# EAGLE schematic HV_amplifier_board_20210802 (EAGLE 9.7.0)
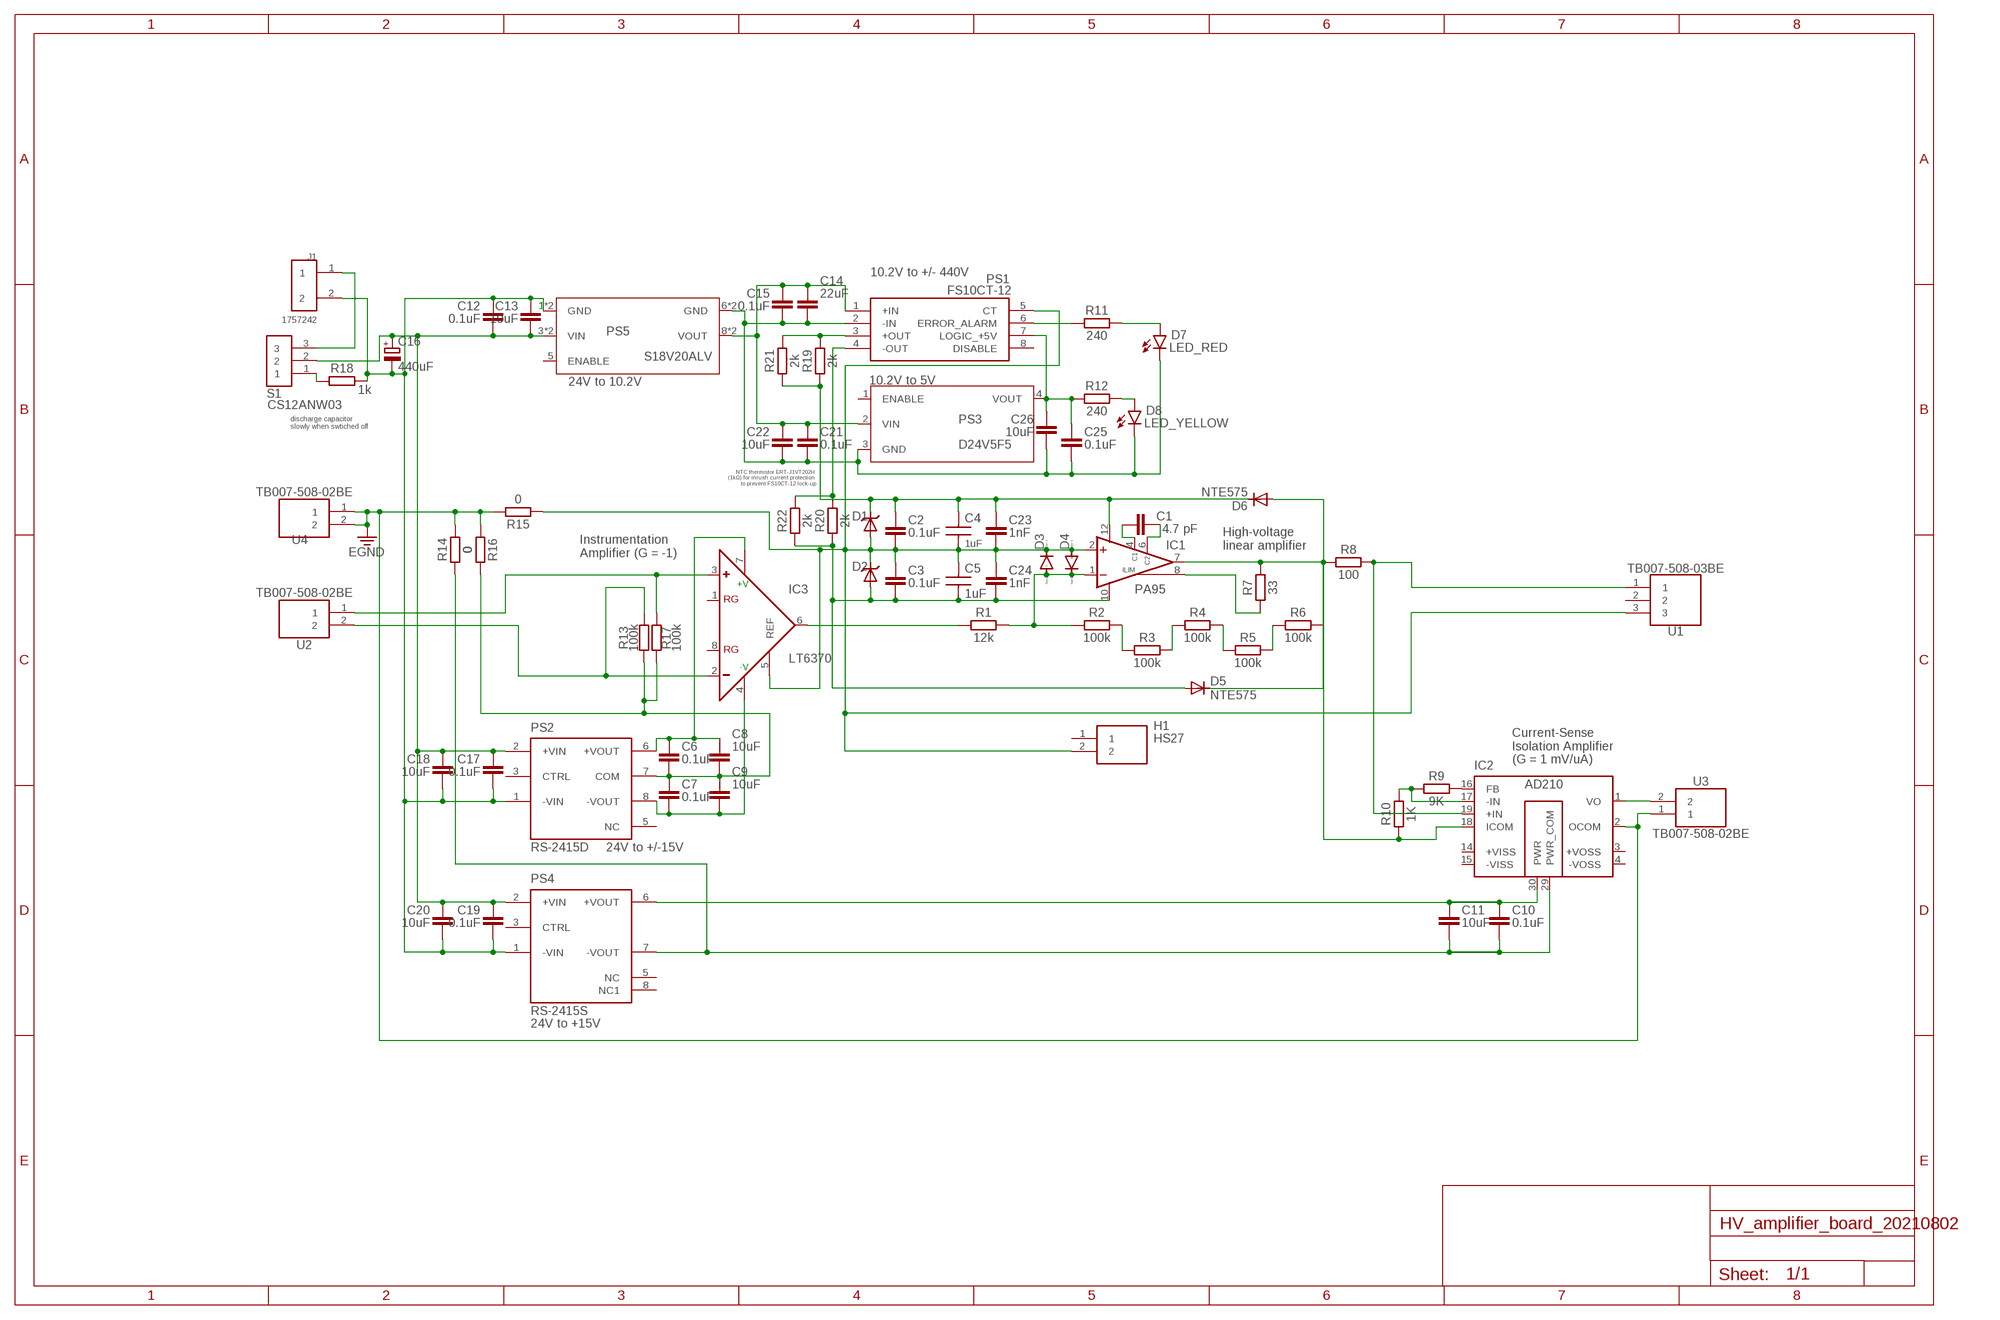
[diagram p0: schematic, sheet 1]

## Parts
C1  4.7 pF  C_DISC_10MM  [C_DISC_10MM]
C2  0.1uF  C_DISC_5.08  [C_DISC_5.08MM]
C3  0.1uF  C_DISC_5.08  [C_DISC_5.08MM]
C4  1uF  C_FILM_27.5MM  [C_FILM_27.5MM]
C5  1uF  C_FILM_27.5MM  [C_FILM_27.5MM]
C6  0.1uF  C_CHIP-0603(1608-METRIC)  [CAPC1608X85]
C7  0.1uF  C_CHIP-0603(1608-METRIC)  [CAPC1608X85]
C8  10uF  C_CHIP-1210(3225-METRIC)  [CAPC3225X135]
C9  10uF  C_CHIP-1210(3225-METRIC)  [CAPC3225X135]
C10  0.1uF  C_CHIP-0603(1608-METRIC)  [CAPC1608X85]
C11  10uF  C_CHIP-1210(3225-METRIC)  [CAPC3225X135]
C12  0.1uF  C_CHIP-0603(1608-METRIC)  [CAPC1608X85]
C13  10uF  C_CHIP-1210(3225-METRIC)  [CAPC3225X135]
C14  22uF  C_CHIP-1210(3225-METRIC)  [CAPC3225X135]
C15  0.1uF  C_CHIP-0603(1608-METRIC)  [CAPC1608X85]
C16  440uF  C-POL_RADIAL-11MM-DIA  [CAPPRD508W65D1000H1100B]
C17  0.1uF  C_CHIP-0603(1608-METRIC)  [CAPC1608X85]
C18  10uF  C_CHIP-1210(3225-METRIC)  [CAPC3225X135]
C19  0.1uF  C_CHIP-0603(1608-METRIC)  [CAPC1608X85]
C20  10uF  C_CHIP-1210(3225-METRIC)  [CAPC3225X135]
C21  0.1uF  C_CHIP-0603(1608-METRIC)  [CAPC1608X85]
C22  10uF  C_CHIP-1210(3225-METRIC)  [CAPC3225X135]
C23  1nF  C_DISC_5.08  [C_DISC_5.08MM]
C24  1nF  C_DISC_5.08  [C_DISC_5.08MM]
C25  0.1uF  C_CHIP-0603(1608-METRIC)  [CAPC1608X85]
C26  10uF  C_CHIP-1210(3225-METRIC)  [CAPC3225X135]
D1  P6KE440A  [DO15-12]
D2  P6KE440A  [DO15-12]
D3  1N4148DO35-7  [DO35-7]
D4  1N4148DO35-7  [DO35-7]
D5  NTE575  [DO15-12]
D6  NTE575  [DO15-12]
D7  LED_RED  LED_RADIAL_RED  [LEDRD254W60D565H860B]
D8  LED_YELLOW  LED_RADIAL_YELLOW  [LEDRD254W60D565H860B_Y]
H1  HS27  [HS27]
IC1  PA95  [SIP8-DQ]
IC2  AD210  [AD210]
IC3  LT6370  [SOIC_08_EP_3P9X4P9_ADI]
J1  1757242  [PHOENIX_1757242]
PS1  FS10CT-12  [FS10CT12]
PS2  RS-2415D  [CONV_RS-2415D]
PS3  D24V5F5  [D24V5F5]
PS4  RS-2415S  [CONV_RS-2415S]
PS5  S18V20ALV  [S18V20ALV]
R1  12k  R_AXIAL-7.2MM-PITCH  [RESAD724W46L381D178B]
R2  100k  R_AXIAL-7.2MM-PITCH  [RESAD724W46L381D178B]
R3  100k  R_AXIAL-7.2MM-PITCH  [RESAD724W46L381D178B]
R4  100k  R_AXIAL-7.2MM-PITCH  [RESAD724W46L381D178B]
R5  100k  R_AXIAL-7.2MM-PITCH  [RESAD724W46L381D178B]
R6  100k  R_AXIAL-7.2MM-PITCH  [RESAD724W46L381D178B]
R7  33  R_AXIAL-7.2MM-PITCH  [RESAD724W46L381D178B]
R8  100  R_AXIAL-11.7MM-PITCH  [RESAD1176W63L850D250B]
R9  9K  R_AXIAL-11.7MM-PITCH  [RESAD1176W63L850D250B]
R10  1K  R_AXIAL-11.7MM-PITCH  [RESAD1176W63L850D250B]
R11  240  R_CHIP-1206(3216-METRIC)  [RESC3216X70]
R12  240  R_CHIP-1206(3216-METRIC)  [RESC3216X70]
R13  100k  R_CHIP-0603(1608-METRIC)  [RESC1608X60]
R14  0  R_AXIAL-11.7MM-PITCH  [RESAD1176W63L850D250B]
R15  0  R_AXIAL-11.7MM-PITCH  [RESAD1176W63L850D250B]
R16  0  R_AXIAL-11.7MM-PITCH  [RESAD1176W63L850D250B]
R17  100k  R_CHIP-0603(1608-METRIC)  [RESC1608X60]
R18  1k  R_CHIP-1206(3216-METRIC)  [RESC3216X70]
R19  2k  R_CHIP-0603(1608-METRIC)  [RESC1608X60]
R20  2k  R_CHIP-0603(1608-METRIC)  [RESC1608X60]
R21  2k  R_CHIP-0603(1608-METRIC)  [RESC1608X60]
R22  2k  R_CHIP-0603(1608-METRIC)  [RESC1608X60]
S1  CS12ANW03  [CS12ANW03]
U1  TB007-508-03BE  [CUI_TB007-508-03BE]
U2  TB007-508-02BE  [CUI_TB007-508-02BE]
U3  TB007-508-02BE  [CUI_TB007-508-02BE]
U4  TB007-508-02BE  [CUI_TB007-508-02BE]

## Nets
24COM: C14.2 C15.2 C21.2 C22.2 C25.2 C26.2 D7.2(C) D8.2(C) PS1.2(-IN) PS3.3(GND) PS5.6(GND) PS5.7(GND)
24V_COM: C12.1 C13.1 C16.2(-) C17.2 C18.2 C19.2 C20.2 J1.2 PS2.1(-VIN) PS4.1(-VIN) PS5.1(GND) PS5.2(GND) R18.2
+V: C6.1 C8.1 IC3.7(+V) PS2.6(+VOUT)
-V: C7.2 C9.2 IC3.4(-V) PS2.8(-VOUT)
COM: C6.2 C7.1 C8.2 C9.1 PS2.7(COM) R13.1 R16.2 R17.1
HV_AMP_OUT [HV]: D5.C D6.A IC1.7(OUT) IC2.18(ICOM) R6.2 R7.2 R8.1 R10.1
HV_COM [HV]: C2.P$2 C3.P$1 C4.1 C5.2 C23.P$2 C24.P$1 D1.A D2.C D3.C D4.A H1.2 IC1.2(+IN) IC3.5(REF) PS1.5(CT) R15.1 U1.3
HV_OUT [HV]: IC2.19(+IN) R8.2 U1.1
IN- [HV]: D3.A D4.C IC1.1(-IN) R1.2 R2.1
N$1: IC2.1(VO) U3.2
N$2 [HV]: R2.2 R3.1
N$3 [HV]: R3.2 R4.1
N$4 [HV]: R4.2 R5.1
N$5 [HV]: R5.2 R6.1
N$6: R18.1 S1.1
N$7: IC1.8(ILIM) R7.1
N$8: C1.P$1 IC1.4(C1)
N$9: C1.P$2 IC1.6(C2)
N$10: C25.1 C26.1 PS1.7(LOGIC_+5V) PS3.4(VOUT) R12.1
N$11: J1.1 S1.3
N$12 [HV]: PS1.3(+OUT) R19.2 R21.2
N$13: PS1.4(-OUT) R20.2 R22.2
N$14 [HV]: IC2.2(OCOM) R14.2 R15.2 R16.1 U3.1 U4.1 U4.2 ; supply symbol labelled EGND
N$15: C14.1 C15.1 C21.1 C22.1 PS1.1(+IN) PS3.2(VIN) PS5.8(VOUT) PS5.9(VOUT)
N$17: C12.2 C13.2 C16.1(+) C17.1 C18.1 C19.1 C20.1 PS2.2(+VIN) PS4.2(+VIN) PS5.3(VIN) PS5.4(VIN) S1.2
N$18: PS1.6(ERROR_ALARM) R11.1
N$19: IC3.2(-) R13.2 U2.2
N$20: IC3.3(+) R17.2 U2.1
N$24: IC2.16(FB) R9.2
N$25: IC2.17(-IN) R9.1 R10.2
N$31: D7.1(A) R11.2
N$33: D8.1(A) R12.2
PWR: C10.1 C11.1 IC2.30(PWR) PS4.6(+VOUT)
PWR_COM: C10.2 C11.2 IC2.29(PWR_COM) PS4.7(-VOUT) R14.1
SIG_IN: IC3.6(OUT) R1.1
V+ [HV]: C2.P$1 C4.2 C23.P$1 D1.C D6.C IC1.12(V+) R19.1 R21.1
V- [HV]: C3.P$2 C5.1 C24.P$2 D2.A D5.A IC1.10(V-) R20.1 R22.1
Unconnected: H1.1 IC2.3(+VOSS) IC2.4(-VOSS) IC2.14(+VISS) IC2.15(-VISS) IC3.1(RG) IC3.8(RG) PS1.8(DISABLE) PS2.3(CTRL) PS2.5(NC) PS3.1(ENABLE) PS4.3(CTRL) PS4.5(NC) PS4.8(NC1) PS5.5(ENABLE) U1.2

## Notes on the sheet
- 10.2V to +/- 440V
- 24V to 10.2V | 10.2V to 5V
- discharge capacitor 
  slowly when swtiched off
- NTC thermistor ERT-J1VT202H 
  (1kΩ) for inrush current protection 
  to prevent FS10CT-12 lock-up
- High-voltage
  linear amplifier
- Instrumentation
  Amplifier (G = -1)
- Current-Sense
  Isolation Amplifier 
  (G = 1 mV/uA)
- 24V to +/-15V
- 24V to +15V

## Library data of the parts
C1 = Passives:C_DISC_10MM: Capacitor disc generic, 10 mm lead spacing for High Voltage
C2 C3 C23 C24 = Passives:C_DISC_5.08: Capacitor disc generic, 5.08 mm lead spacing for High Voltage
C4 C5 = Passives:C_FILM_27.5MM: Film Capacitors Generic Polypropylene Capacitor PP 27.5 mm lead spacing Source: Datasheet <https://api.kemet.com/component-edge/download/datasheet/C4AQSBU4100A1WJ.pdf>; DESCRIPTION: Kemet-BHC 1uF Polypropylene Capacitor PP 1.5kV dc +/-5% Tolerance C4AQ Series; HEIGHT: 20.2mm; MANUFACTURER_NAME: Kemet-BHC; MANUFACTURER_PART_NUMBER: C4AQSBU4100A1WJ; MOUSER_PART_NUMBER: 80-C4AQSBU4100A1WJ; MOUSER_PRICE-STOCK: https://www.mouser.com/Search/Refine.aspx?Keyword=80-C4AQSBU4100A1WJ
C6-C15 C17-C22 C25 C26 = Capacitor:C: Capacitor - Generic; CATEGORY: Capacitor
C16 = Capacitor:C-POL: Capacitor Polarised - Generic; CATEGORY: Capacitor
D1 D2 = Passives:P6KE440A: TVS DIODE Zener diode, P6KE440A DO-15 package; AVAILABILITY: Warning; DESCRIPTION: Diode Standard 800V 2A Through Hole DO-15; MF: ON; MP: EGP20KTA; PACKAGE: DO-15 Fairchild Semiconductor; PRICE: None; PURCHASE-URL: https://pricing.snapeda.com/search/part/EGP20KTA/?ref=eda
D3 D4 = Passives:1N4148: DIODE high speed (Philips)
D5 D6 = Passives:NTE575: Fast switching DIODE 1N5623GP DO-15 package; AVAILABILITY: Warning; DESCRIPTION: Diode Standard 800V 2A Through Hole DO-15; MF: ON; MP: EGP20KTA; PACKAGE: DO-15 Fairchild Semiconductor; PRICE: None; PURCHASE-URL: https://pricing.snapeda.com/search/part/EGP20KTA/?ref=eda
D7 D8 = Opto-Electronic:LED_RADIAL: LED - Generic; CATEGORY: Opto-Electronic; SUB-CATEGORY: LED
H1 = APEX components:HS27: HEATSINK 12P PWR SIP Source: Datasheet <https://www.apexanalog.com/resources/mechdrawings/hs27.pdf>; DESCRIPTION: HEATSINK 12P PWR SIP; HEIGHT: 76.2mm; MANUFACTURER_NAME: Apex Microtechnology; MANUFACTURER_PART_NUMBER: HS27
IC1 = APEX components:PA95: HIGH VOLTAGE POWER OPERATIONAL AMPLIFIER (900V) Source: www.apexmicrotech.com .. pa94u.pdf Check prices <https://pricing.snapeda.com/parts/PA94/Apex%20Microtechnology/view-part?ref=eda>; AVAILABILITY: Warning; DESCRIPTION: Power Amplifier 1 Circuit 8-SIP; MF: Apex Microtechnology; MP: PA94; PACKAGE: SIP-8 Apex Microtechnology; PRICE: None; PURCHASE-URL: https://pricing.snapeda.com/search/part/PA94/?ref=eda
IC2 = Analog Devices:AD210: Precision, Wide Bandwidth 3-Port Isolation Amplifier Source: http://www.analog.com/static/imported-files/data_sheets/AD210.pdf; MF: ALTERA CORPORATION; MPN: AD210AN; OC_FARNELL: 3182034; OC_NEWARK: 05F6727
IC3 = Analog Devices:LT6370; COPYRIGHT: Copyright (C) 2018 Accelerated Designs. All rights reserved; DATASHEET: https://www.analog.com/media/en/technical-documentation/data-sheets/LT6370.pdf; MANUFACTURER_PART_NUMBER: LT6370AHS8E#PBF; SOURCELIBRARY: Add_to_database_2021-02-02; VENDOR: Analog Devices Inc
J1 = Connectors:1757242: Phoenix 1757242 MSTBA 2.5/ 2-G-5.08 Base Strip/Header 4 Kilo-Volt Surge 320 Volt Rated III/2 12 Amp Green Plug-In; DESCRIPTION: 2 Position Terminal Block Header, Male Pins, Shrouded (4 Side) 0.200 (5.08mm) 90°, Right Angle Through Hole; DIGI-KEY_PART_NUMBER: 277-1106-ND; MF: Phoenix Contact; MP: 1757242; PACKAGE: None; PURCHASE-URL: https://pricing.snapeda.com/search/part/1757242/?ref=eda
PS1 = XP Power:FS10CT-12: XP Power FS10CT-12 DC to High Voltage DC Converter 0 12 V dc 10mA 1kV Source: Datasheet <https://www.xppower.com/Portals/0/pdfs/SF_FS_Series.pdf>; DESCRIPTION: XP Power FS10CT-12 DC to High Voltage DC Converter 0 12 V dc 10mA 1kV; HEIGHT: 12.7mm; MANUFACTURER_NAME: XP POWER; MANUFACTURER_PART_NUMBER: FS10CT-12
PS2 = DC-DC convertors:RS-2415D: DC/DC Converter, 2 Watt SIP8 Single & Dual Output; DESCRIPTION: 2W DC/DC-Converter 'ECONOLINE' SIP8 1kV reg 2:1; DIGI-KEY_PART_NUMBER: 945-1985-5-ND; MF: Recom Power; MP: RS-2415D; PACKAGE: SIP-8 Recom Power; PURCHASE-URL: https://pricing.snapeda.com/search/part/RS-2415D/?ref=eda
PS3 = Polulu:D24V5F5: The compact (0.4″ × 0.5″) D24V5F5 synchronous buck voltage regulator takes an input voltage of 5.1 V up to 36 V and efficiently reduces it to 5 V while allowing for a maximum output current of 500 mA. Polulu Link: https://www.pololu.com/product/2843
PS4 = DC-DC convertors:RS-2415S: DC/DC Converter, 2 Watt SIP8 Single & Dual Output; DESCRIPTION: 2W DC/DC-Converter 'ECONOLINE' SIP8 1kV reg 2:1; DIGI-KEY_PART_NUMBER: 945-1984-5-ND; MF: Recom Power; MP: RS-2415S; PACKAGE: SIP-8 Recom Power; PURCHASE-URL: https://pricing.snapeda.com/search/part/RS-2415S/?ref=eda
PS5 = Polulu:S18V20ALV: Pololu Adjustable 4-12V Step-Up/Step-Down Voltage Regulator S18V20ALV
R1-R22 = Resistor:R: Resistor Fixed - Generic; CATEGORY: Resistor; SUB-CATEGORY: Fixed
S1 = Connectors:CS12ANW03: NKK SWITCHES - CS12ANW03 - SWITCH, SLIDE, SPDT, 3A, 250V, TH Source: Datasheet <http://www.nkkswitches.com/pdf/cs.pdf>; ARROW_PART_NUMBER: CS12ANW03; ARROW_PRICE-STOCK: https://www.arrow.com/en/products/cs12anw03/nkk-switches; DESCRIPTION: NKK SWITCHES - CS12ANW03 - SWITCH, SLIDE, SPDT, 3A, 250V, TH; HEIGHT: mm; MANUFACTURER_NAME: NKK Switches; MANUFACTURER_PART_NUMBER: CS12ANW03; MOUSER_PART_NUMBER: 633-CS12ANW03; MOUSER_PRICE-STOCK: https://www.mouser.co.uk/ProductDetail/NKK-Switches/CS12ANW03?qs=4P1McwaGddbVHu%252BBZT0egw%3D%3D
U1 = Connectors:TB007-508-03BE: Check prices <https://pricing.snapeda.com/parts/TB007-508-03BE/CUI%20Devices/view-part?ref=eda>; AVAILABILITY: Good; CUI_PURCHASE_URL: https://www.cuidevices.com/product/interconnect/connectors/terminal-blocks/tb007-508-series?utm_source=snapeda.com&utm_medium=referral&utm_campaign=snapedaBOM; DESCRIPTION: 2~24 Poles, Screw Type, Horizontal, 5.08 Pitch, 24~12 (AWG), Terminal Block Connector; MF: CUI Devices; MP: TB007-508-03BE; PACKAGE: None; PRICE: None; PURCHASE-URL: https://pricing.snapeda.com/search/part/TB007-508-03BE/?ref=eda
U2-U4 = Connectors:TB007-508-02BE; CUI_PURCHASE_URL: https://www.cuidevices.com/product/interconnect/connectors/terminal-blocks/tb007-508-series?utm_source=snapeda.com&utm_medium=referral&utm_campaign=snapedaBOM; DESCRIPTION: 2~24 Poles, Screw Type, Horizontal, 5.08 Pitch, 24~12 (AWG), Terminal Block Connector; DIGI-KEY_PART_NUMBER: 102-6203-ND; MF: CUI Devices; MP: TB007-508-02BE; PACKAGE: None